# Altium project UNOshield.PrjPcb (part 2 of 2)

## Sheet Buzzer.SchDoc
size A
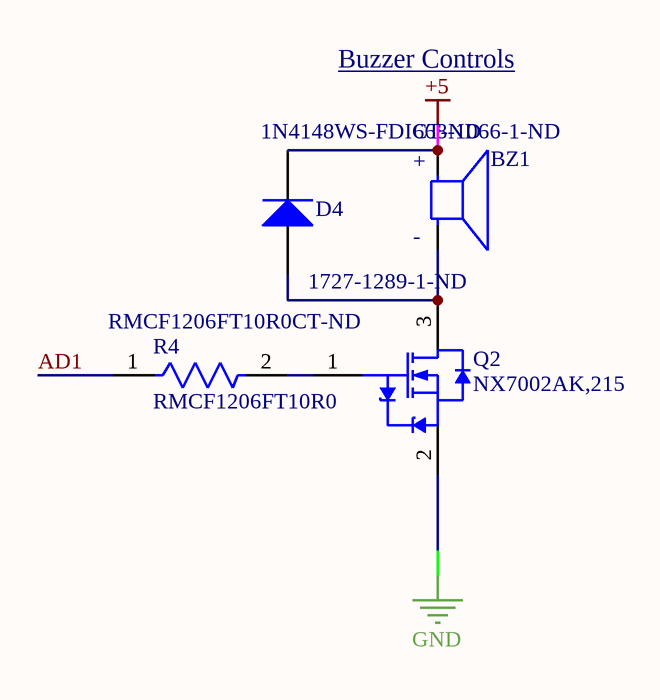
[diagram p4: Buzzer.SchDoc]

### Parts
BZ1  Supplier Part Number 1: 668-1066-1-ND  [XDCR_SMT-0823-S-R]  (hidden comment: SMT-0823-S-R)
D4  Supplier Part Number 1: 1N4148WS-FDICT-ND  [DIOD-SOD323-2-A_V]  (hidden comment: 1N4148WS-7-F)
Q2  NX7002AK,215  Supplier Part Number 1: 1727-1289-1-ND  [NXP-SOT23_L]
R4  RMCF1206FT10R0  Supplier Part Number 1: RMCF1206FT10R0CT-ND  [FP-RMCF1206-IPC_C]

### Nets
+5: BZ1.P(POS) D4.2(K)  [project net 5V]
GND: Q2.2(S)
AD1: R4.1
NetBZ1_N: BZ1.N(NEG) D4.1(A) Q2.3(D)
NetQ2_1: Q2.1(G) R4.2

### Notes on the sheet
- Buzzer Controls
- (in symbol SMT-0823-S-R) +; -

### Library data of the parts
BZ1 = SMT-0823-S-R: Audio Indicator Transducer Electromagnetic 5Vp-p 70mA Solder Pad 3Vp-p 1800Hz to 2800Hz Surface Mount; Manufacturer: Projects Unlimited; MF: PUI Audio; Package: None; Price: None; Value: *; MP: SMT-0823-S-R; Availability: Unavailable; Supplier: Digikey; Supplier Part Number: 668-1066-1-ND; Manufacturer Part Number: SMT-0823-S-R; RoHS: Yes; Category: Audio Products; Stock: 12556; Pricing: 1=3.22, 10=2.625, 25=2.4196, 50=2.275, 100=2.1395, 250=1.97344, 500=1.85702 (USD); ComponentLink1URL: https://datasheet.ciiva.com/4625/smt-0823-s-r-71464-4625676.pdf?src-supplier=Mouser; ComponentLink1Description: https://datasheet.ciiva.com/4625/smt-0823-s-r-71464-4625676.pdf?src-supplier=Mouser; ComponentLink2URL: https://datasheet.ciiva.com/8113/smt-0823-s-r-8113345.pdf?src-supplier=Avnet; ComponentLink2Description: https://datasheet.ciiva.com/8113/smt-0823-s-r-8113345.pdf?src-supplier=Avnet; ComponentLink3URL: https://datasheet.ciiva.com/0/smt-0823-s-r-315.pdf?src-supplier=Digikey; ComponentLink3Description: https://datasheet.ciiva.com/0/smt-0823-s-r-315.pdf?src-supplier=Digikey; Supplier 1: Digikey; Stock 1: 11050; Pricing 1: 1=3.26, 10=2.652, 25=2.4444, 50=2.2984, 100=2.2129 (USD)
D4 = CMP-1667-00004-1: Fast Switching Diode, 75 V, 0.3 A, -65 to 150 degC, 2-Pin SOD323, RoHS, Tape and Reel; Manufacturer: Diodes; Description: Rectifier Diode, 1 Phase, 1 Element, 0.15A, 75V V(RRM), Silicon; Diode Element Material: SILICON; Package Body Material: Plastic; Additional Feature: HIGH RELIABILITY; Diode Type: RECTIFIER; Forward Voltage: 715mV; Non-rep Pk Forward Current-Max: 2A; Number of Elements: 1; Max Output current: 150mA; Max Power Dissipation: 200mW; Rep Pk Reverse Voltage-Max: 75V; Reverse Recovery Time-Max: 0.004us; Time @ Peak Reflow Temperature-Max (s): 30s; Qualification Status: Not Qualified; DatasheetVersion: Rev. 25-2, 03/2016; PackageDescription: 2-Pin Small Outline Diode, Body 1.7 x 1.3 mm; ComponentLink2Description: Datasheet; ComponentLink1URL: http://www.diodes.com/; PackageReference: SOD323-2; ComponentLink2URL: http://www.diodes.com/datasheets/ds30097.pdf; ComponentLink1Description: Manufacturer URL; Supplier 1: Digikey; Manufacturer Part Number: 1N4148WS-7-F; RoHS: Yes; Category: Rectifier Diodes; Stock 1: 593066; Pricing 1: 1=0.1, 10=0.031, 3000=0.0202, 6000=0.017, 9000=0.0161, 15000=0.01599, 21000=0.01592, 30000=0.01585, 75000=0.01569, 150000=0.0156, 300000=0.01551 (USD); Pins: 2; Package Shape: Rectangular; Terminal Finish: Tin; Min Operating Temperature: -65°C; Max Operating Temperature: 150°C; JESD-609 Code: e3; JESD-30 Code: R-PDSO-G2; Moisture Sensitivity Level: 1; Package Style: SMALL OUTLINEMeter; Peak Reflow Temperature (Cel): 260°C; Surface Mount: Yes; Terminal Form: Gull Wing; Terminal Position: DUAL; Reach SVHC Compliant: Yes; RoHS Compliant: Yes; ComponentLink3URL: https://datasheet.ciiva.com:443/pdfs/VipMasterIC/IC/DIOD/DIOD-S-A0001754954/DIOD-S-A0001754954-1.pdf?src-supplier=IHS+Markit; ComponentLink3Description: https://datasheet.ciiva.com:443/pdfs/VipMasterIC/IC/DIOD/DIOD-S-A0001754954/DIOD-S-A0001754954-1.pdf?src-supplier=IHS+Markit; ComponentLink4URL: https://datasheet.ciiva.com/911/ds30097-911742.pdf?src-supplier=Digikey; ComponentLink4Description: https://datasheet.ciiva.com/911/ds30097-911742.pdf?src-supplier=Digikey; ComponentLink5URL: https://datasheet.ciiva.com/911/ds30097-911741.pdf?src-supplier=Digikey; ComponentLink5Description: https://datasheet.ciiva.com/911/ds30097-911741.pdf?src-supplier=Digikey; ComponentLink6URL: https://datasheet.ciiva.com/911/ds30097-911743.pdf?src-supplier=Digikey; ComponentLink6Description: https://datasheet.ciiva.com/911/ds30097-911743.pdf?src-supplier=Digikey; ComponentLink7URL: https://datasheet.ciiva.com/8300/ds30097-8300396.pdf?src-supplier=Avnet; ComponentLink7Description: https://datasheet.ciiva.com/8300/ds30097-8300396.pdf?src-supplier=Avnet; ComponentLink8URL: https://datasheet.ciiva.com/1179/ds30097-1179355.pdf?src-supplier=Element14; ComponentLink8Description: https://datasheet.ciiva.com/1179/ds30097-1179355.pdf?src-supplier=Element14
Q2 = CMP-1258-00137-1: Single N-Channel Trench MOSFET, 60 V, -55 to 150 degC, 3-Pin SOT23, Tape and Reel; Manufacturer: NXP Semiconductors; Packing: Tape & Reel; VGSth [typ] (V): 1.6; Coss [typ] (pF): 3.4; Channel Type: N; Ciss [typ] (pF): 11; VDS [max] (V): 60; Description: Small Signal Field-Effect Transistor, 0.19A I(D), 60V, 1-Element, N-Channel, Silicon, Metal-oxide Semiconductor FET, TO-236AB; Package Body Material: Plastic; Transistor Element Material: SILICON; Drain Current-Max (ID): 190mA; Drain-source On Resistance-Max: 5.2R; DS Breakdown Voltage-Min: 60V; FET Technology: METAL-OXIDE SEMICONDUCTOR; Number of Elements: 1; Operating Mode: ENHANCEMENT MODE; Transistor Application: SWITCHING; Reference Standard: IEC-60134; JEDEC-95 Code: TO-236AB; ComponentLink2Description: Datasheet; PackageDescription: 3-Pin Small Outline Transistor Package, Body 2.9 x 1.3 mm, Pitch 0.95 mm; Mounting Technology: Surface Mount; PackageVersion: 06-03-16, 03/2006; Code_JEDEC: TO-236AB; ComponentLink3Description: Package Specification; DatasheetVersion: Rev. 5; ComponentLink2URL: http://www.nxp.com/documents/data_sheet/NX7002AK.pdf; ComponentLink1URL: http://www.nxp.com/; ComponentLink1Description: Manufacturer URL; PackageReference: SOT23; PartNumber: NX7002AK,215; ComponentLink3URL: http://www.nxp.com/documents/outline_drawing/sot023_po.pdf; Supplier 1: Digikey; Manufacturer Part Number: NX7002AK,215; RoHS: Yes; Category: MOSFETs; Stock 1: 306595; Pricing 1: 1=0.13, 10=0.088, 100=0.0428, 500=0.04112, 1000=0.0363 (USD); Pins: 3; Package Shape: Rectangular; Terminal Finish: Tin; JESD-609 Code: e3; Polarity/Channel Type: N-CHANNEL; JESD-30 Code: R-PDSO-G3; Moisture Sensitivity Level: 1; Package Style: SMALL OUTLINEMeter; Surface Mount: Yes; Terminal Form: Gull Wing; Terminal Position: DUAL; Reach SVHC Compliant: Yes; RoHS Compliant: Yes; ComponentLink4URL: https://datasheet.ciiva.com:443/pdfs/VipMasterIC/IC/PHGL/PHGLS26009/PHGLS26012-1.pdf?src-supplier=IHS+Markit; ComponentLink4Description: https://datasheet.ciiva.com:443/pdfs/VipMasterIC/IC/PHGL/PHGLS26009/PHGLS26012-1.pdf?src-supplier=IHS+Markit; ComponentLink5URL: http://www.farnell.com/datasheets/1968065.pdf?src-supplier=Farnell; ComponentLink5Description: http://www.farnell.com/datasheets/1968065.pdf?src-supplier=Farnell; ComponentLink6URL: http://www.farnell.com/datasheets/1968065.pdf?src-supplier=Newark; ComponentLink6Description: http://www.farnell.com/datasheets/1968065.pdf?src-supplier=Newark
R4 = CMP-26527-000112-1: RES 10 OHM 1% 1/4W 1206; Manufacturer: Stackpole Electronics; Temperature Coefficient: 100ppm/°C; Resistance: 10R; Working Voltage: 200V; Max Power Dissipation: 250mW; Description: Fixed Resistor, Metal Glaze/thick Film, 0.25W, 10ohm, 200V, 1% +/-Tol, 100ppm/Cel, Surface Mount, 1206; Rated Temperature: 70°C; Value: 10R; Temperature Coefficient (ppm/Cel): 100; Package Height: 0.55mm; Package Length: 3.2mm; Package Width: 1.6mm; Reference Standard: AEC-Q200; Width: 0.063inch; Case/Package: 1206; Series: RMCF; Number of Terminations: 2; Case Code (Imperial): 1206; Contact Plating: Tin; Packaging: Tape and Reel; Lead Free: Lead Free; Depth: 1.6mm; Case Code (Metric): 3216; RoHS Compliant: Yes; Height: 0.028inch; Resistor Type: Thick Film; Tolerance: 1%; Military Standard: Not; Radiation Hardening: No; Mount: Surface Mount; Length: 3.2mm; Power Rating: 250mW; Min Operating Temperature: -55°C; Features: Automotive AEC-Q200; Construction: Rectangular; Max Operating Temperature: 155°C; Supplier 1: Digikey; Manufacturer Part Number: RMCF1206FT10R0; RoHS: Yes; Category: Chip SMD Resistors; Stock 1: 402347; Pricing 1: 1=0.1, 10=0.029, 100=0.0144, 1000=0.00806, 2500=0.00702 (USD); Mounting Technology: Surface Mount; Pins: 2; Package Shape: Rectangular; Terminal Finish: Nickel; JESD-609 Code: e3; Power: 250mW; Technology: METAL GLAZE/THICK FILM; Termination: Wraparound; Reach SVHC Compliant: Yes; ComponentLink1URL: https://datasheet.ciiva.com:443/pdfs/VipMasterIC/IC/SEIE/SEIE-S-A0009541969/SEIE-S-A0009541969-1.pdf?src-supplier=IHS+Markit; ComponentLink1Description: https://datasheet.ciiva.com:443/pdfs/VipMasterIC/IC/SEIE/SEIE-S-A0009541969/SEIE-S-A0009541969-1.pdf?src-supplier=IHS+Markit; ComponentLink2URL: https://datasheet.ciiva.com/15193/getdatasheetpartid-408274-15193660.pdf?src-supplier=Verical; ComponentLink2Description: https://datasheet.ciiva.com/15193/getdatasheetpartid-408274-15193660.pdf?src-supplier=Verical

## Sheet LCD.SchDoc
size A
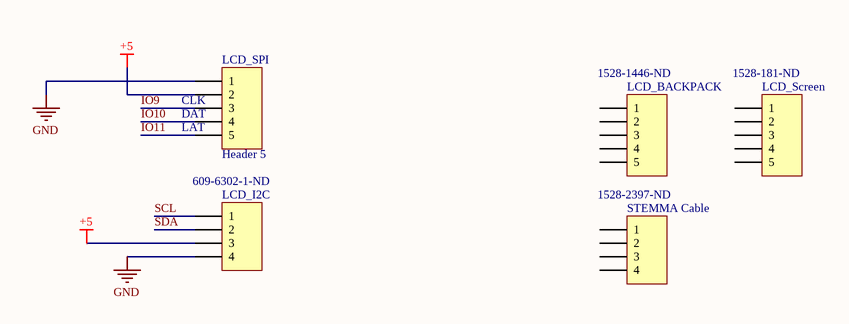
[diagram p5: LCD.SchDoc]

### Parts
LCD_BACKPACK  Supplier Part Number 1: 1528-1446-ND  [HDR1X5]  (mechanical)
LCD_I2C  Supplier Part Number 1: 609-6302-1-ND  [10147606-00004LF]
LCD_Screen  Supplier Part Number 1: 1528-181-ND  [HDR1X5]  (mechanical)
LCD_SPI  Header 5  [HDR1X5]
STEMMA_Cable  Supplier Part Number 1: 1528-2397-ND  [10147606-00004LF]  (mechanical)

### Nets
+5: LCD_I2C.3 LCD_SPI.2  [project net 5V]
GND: LCD_I2C.4 LCD_SPI.1
IO9: LCD_SPI.3
IO10: LCD_SPI.4
IO11: LCD_SPI.5
SCL: LCD_I2C.1
SDA: LCD_I2C.2

Not connected (* = marked no-connect by the designer): LCD_BACKPACK 1 2 3 4 5; LCD_Screen 1 2 3 4 5; STEMMA_Cable 1 2 3 4

### Notes on the sheet
- (near LCD_SPI) CLK
- (near LCD_SPI) DAT
- (near LCD_SPI) LAT

### Library data of the parts
LCD_BACKPACK = Header 5: I2C/Spi Character Lcd Backpack - Stemma Qt/Qwiic Rohs Compliant: Yes |Adafruit 292; Manufacturer: Adafruit Industries; Manufacturer Part Number: 292; Supplier 1: Digikey; RoHS: Yes; Category: Optoelectronics; Stock 1: 86; Pricing 1: 1=9.95 (USD); ComponentLink1URL: http://www.alliedelec.com/m/d/fbf915f4a11a953f4c276fdc61ad8095.pdf?src-supplier=Allied+Electronics; ComponentLink1Description: http://www.alliedelec.com/m/d/fbf915f4a11a953f4c276fdc61ad8095.pdf?src-supplier=Allied+Electronics; ComponentLink2URL: https://learn.adafruit.com/downloads/pdf/i2c-spi-lcd-backpack.pdf?src-supplier=Digikey; ComponentLink2Description: https://learn.adafruit.com/downloads/pdf/i2c-spi-lcd-backpack.pdf?src-supplier=Digikey
LCD_I2C = Header 4: Connector Shrouded Header 4 Position Right Angle Surface Mount T/R; Manufacturer: AMPHENOL ICC (FCI); Supplier 1: Digikey; Manufacturer Part Number: 10147606-00004LF; RoHS: No
LCD_Screen = Header 5: Standard LCD 16x2 + extras - white on blue | Adafruit Industries 181; Manufacturer Part Number: 181; Supplier 1: Digikey; Manufacturer: Adafruit Industries; RoHS: Yes; Stock 1: 47; Pricing 1: 1=9.95 (USD); ComponentLink1URL: https://cdn-shop.adafruit.com/datasheets/HD44780.pdf?src-supplier=Digikey; ComponentLink1Description: https://cdn-shop.adafruit.com/datasheets/HD44780.pdf?src-supplier=Digikey
LCD_SPI = Header 5: Header, 5-Pin; LatestRevisionDate: 17-Jul-2002; LatestRevisionNote: Re-released for DXP Platform.; Publisher: Altium Limited
STEMMA_Cable = Header 4: Holder; Fuse; Auto Blade; Mini; 500VAC; 30A; PC Pin Terminal; Nylon 4/6 Holder; Black; Manufacturer: Adafruit Industries; Manufacturer Part Number: 3568; Supplier 1: Digikey; RoHS: No; Stock 1: 325; Pricing 1: 1=0.75 (USD); ComponentLink1URL: https://media.digikey.com/pdf/Data%20Sheets/Adafruit%20PDFs/3568_Web.pdf?src-supplier=Digikey; ComponentLink1Description: https://media.digikey.com/pdf/Data%20Sheets/Adafruit%20PDFs/3568_Web.pdf?src-supplier=Digikey

## Nets that join several sheets
5V: EM4095 (C2.1 EM4095_EXT.9), MAX490 (C1.1 U1.1), UNOshield (H_PWR.4 Motion_Sensor.3 RD.1 RR.2), Door_Actuator (K1.1), Buzzer (BZ1.P D4.2), LCD (LCD_I2C.3 LCD_SPI.2)
+24: UNOshield (24V_Barrel.A), Door_Actuator (K1.3)
GND: EM4095 (C2.2 EM4095_EXT.10), MAX490 (C1.2 RJ45.1 U1.4), UNOshield (8 pins), Door_Actuator (D3.1 Door_Act.2 Q1.2), Buzzer (Q2.2), LCD (LCD_I2C.4 LCD_SPI.1)
AD1: UNOshield (H_AD.2), Buzzer (R4.1)
AD3: EM4095 (EM4095_EXT.3), UNOshield (H_AD.4)
AD4: EM4095 (EM4095_EXT.4), UNOshield (H_AD.5)
AD5: EM4095 (EM4095_EXT.2), UNOshield (H_AD.6)
IO0: MAX490 (U1.2), UNOshield (H_IOL.1)
IO1: MAX490 (U1.3), UNOshield (H_IOL.2)
IO6: UNOshield (H_IOL.7), Door_Actuator (R3.1)
IO8: EM4095 (EM4095_EXT.1), UNOshield (H_IOH.1)
IO9: UNOshield (H_IOH.2), LCD (LCD_SPI.3)
IO10: UNOshield (H_IOH.3), LCD (LCD_SPI.4)
IO11: UNOshield (H_IOH.4), LCD (LCD_SPI.5)
SCL: UNOshield (H_IOH.10), LCD (LCD_I2C.1)
SDA: UNOshield (H_IOH.9), LCD (LCD_I2C.2)